# Altium project CAN-USB-Converter.PrjPcb
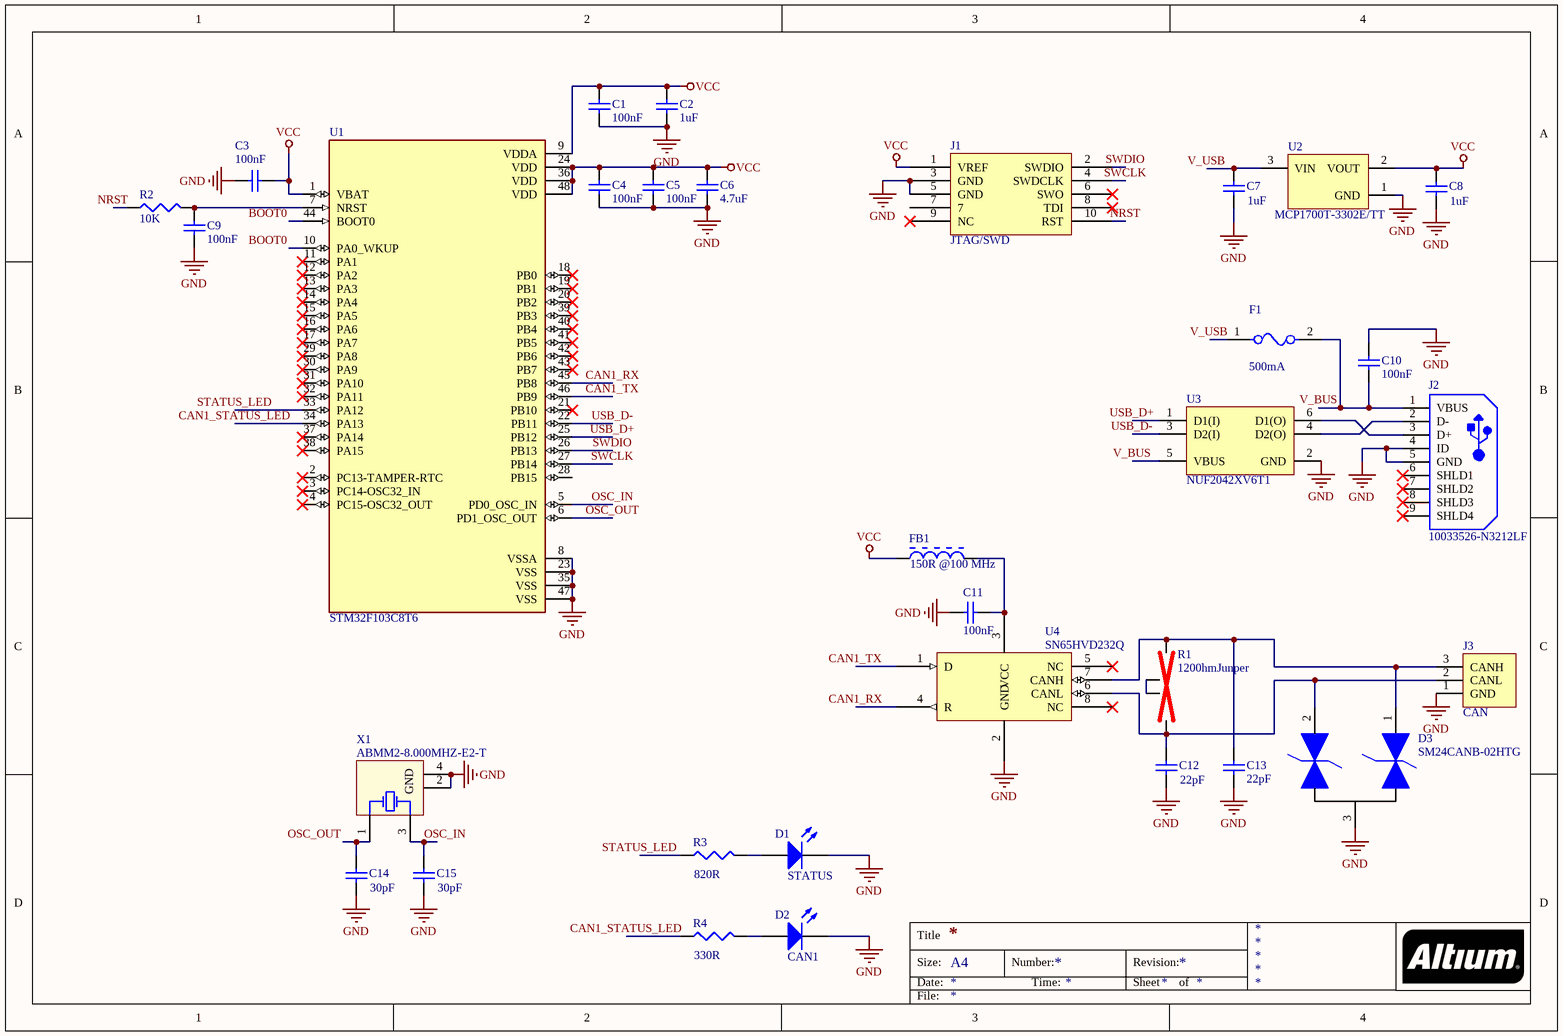
[diagram p0: Sheet1.SchDoc]
1 sheet, 32 parts. Net scope: global (net labels, ports and power ports of the same name join across sheets).
Board file: PCB2.PcbDoc

## Sheet Sheet1.SchDoc
size A4

### Parts
C1  value 100nF  [CAP0805]  (hidden comment: Cap Semi)
C2  value 1uF  [CAP0805]  (hidden comment: Cap Semi)
C3  value 100nF  [CAP0805]  (hidden comment: Cap Semi)
C4  value 100nF  [CAP0805]  (hidden comment: Cap Semi)
C5  value 100nF  [CAP0805]  (hidden comment: Cap Semi)
C6  value 4.7uF  [CAP0805]  (hidden comment: Cap Semi)
C7  value 1uF  [CAP0805]  (hidden comment: Cap Semi)
C8  value 1uF  [CAP0805]  (hidden comment: Cap Semi)
C9  value 100nF  [CAP0805]  (hidden comment: Cap Semi)
C10  value 100nF  [CAP0805]  (hidden comment: Cap Semi)
C11  value 100nF  [CAP0805]  (hidden comment: Cap Semi)
C12  value 22pF  [CAP0805]  (hidden comment: Cap Semi)
C13  value 22pF  [CAP0805]  (hidden comment: Cap Semi)
C14  value 30pF  [CAP0805]  (hidden comment: Cap Semi)
C15  value 30pF  [CAP0805]  (hidden comment: Cap Semi)
D1  STATUS  [0603_A]
D2  CAN1  [0603_A]
D3  SM24CANB-02HTG  [SOT-23-3]
F1  500mA  [FP-0154-MFG]
FB1  150R @100 MHz  [MURA-BLM21-H1-CHIP-2_V]
J1  JTAG/SWD  [61301021021]
J2  10033526-N3212LF  [FCI-10033526-N3212LF_V]
J3  CAN  [3PIN-Screw-Terminal]
R1  1200hmJunper  [120ohmJumper]
R2  value 10K  [RES0805]  (hidden comment: Res3)
R3  value 820R  [RES0805]  (hidden comment: Res3)
R4  value 330R  [RES0805]  (hidden comment: Res3)
U1  STM32F103C8T6  [STM32F103C8T6]
U2  MCP1700T-3302E/TT  [SOT-23-TT3_N]
U3  NUF2042XV6T1  [ONSC-SOT-563-6-463A-01_V]
U4  SN65HVD232Q  [SO-8_S]
X1  ABMM2-8.000MHZ-E2-T  [ABRA-ABMM2-4_V]

### Nets
GND: C1.1 C2.1 C3.1 C4.1 C5.1 C6.1 C7.1 C8.1 C9.1 C10.1 C11.1 C12.1 C13.2 C14.1 C15.1 D1.1(K) D2.1(K) D3.3 J1.3(GND) J1.5(GND) J2.4(ID) J2.5(GND) J3.1(GND) U1.8(VSSA) U1.23(VSS) U1.35(VSS) U1.47(VSS) U2.1(GND) U3.2(GND) U4.2(GND) X1.2(GND) X1.4(GND)
VCC: C1.2 C2.2 C3.2 C4.2 C5.2 C6.2 C8.2 FB1.1 J1.1(VREF) U1.1(VBAT) U1.9(VDDA) U1.24(VDD) U1.36(VDD) U1.48(VDD) U2.2(VOUT)
BOOT0: U1.10(PA0_WKUP) U1.44(BOOT0)
CAN1_RX: U1.45(PB8) U4.4(R)
CAN1_STATUS_LED: R4.1 U1.34(PA13)
CAN1_TX: U1.46(PB9) U4.1(D)
NRST: J1.10(RST) R2.2
OSC_IN: C15.2 U1.5(PD0_OSC_IN) X1.3(X2)
OSC_OUT: C14.2 U1.6(PD1_OSC_OUT) X1.1(X1)
STATUS_LED: R3.1 U1.33(PA12)
SWCLK: J1.4(SWDCLK) U1.27(PB14)
SWDIO: J1.2(SWDIO) U1.26(PB13)
USB_D+: U1.25(PB12) U3.1(D1(I))
USB_D-: U1.22(PB11) U3.3(D2(I))
V_BUS: C10.2 F1.2 J2.1(VBUS) U3.5(VBUS)
V_USB: C7.2 F1.1 U2.3(VIN)
NetC9_2: C9.2 R2.1 U1.7(NRST)
NetC11_2: C11.2 FB1.2 U4.3(VCC)
NetC12_2: C12.2 D3.2 J3.2(CANL) R1.2 U4.6(CANL)
NetC13_1: C13.1 D3.1 J3.3(CANH) R1.1 U4.7(CANH)
NetD1_2: D1.2(A) R3.2
NetD2_2: D2.2(A) R4.2
NetJ2_2: J2.2(D-) U3.4(D2(O))
NetJ2_3: J2.3(D+) U3.6(D1(O))
NetR1_3: R1.3 R1.4

Not connected (* = marked no-connect by the designer): J1 6(SWO)* 7 8(TDI)* 9(NC)*; J2 6(SHLD1)* 7(SHLD2)* 8(SHLD3)* 9(SHLD4)*; U1 2(PC13-TAMPER-RTC)* 3(PC14-OSC32_IN)* 4(PC15-OSC32_OUT)* 11(PA1)* 12(PA2)* 13(PA3)* 14(PA4)* 15(PA5)* 16(PA6)* 17(PA7)* 18(PB0)* 19(PB1)* 20(PB2)* 21(PB10)* 28(PB15) 29(PA8)* 30(PA9)* 31(PA10)* 32(PA11)* 37(PA14)* 38(PA15)* 39(PB3)* 40(PB4)* 41(PB5)* 42(PB6)* 43(PB7)*; U4 5(NC)* 8(NC)*

### Notes on the sheet
- Title
- Size:
- Date:
- A4
- Number:
- Time:
- Revision:
- Sheet
- of
- File:

### Library data of the parts
C1-C15 = Cap Semi: Capacitor (Semiconductor SIM Model); Published: 8-Jun-2000; LatestRevisionDate: 29-May-2009; LatestRevisionNote: IPC-7351 Footprint Added.; PackageReference: C1206; Publisher: Altium Limited; PackageDescription: Chip Capacitor
D1 = CMP-1426-00001-1: SMD mono-color Chip LED, WL-SMCW, Red; Manufacturer: Wuerth Elektronik; PartNumber: 150060RS75000; Color: Red; PackageReference: 0603_A; ComponentLink2URL: http://katalog.we-online.com/led/datasheet/150060RS75000.pdf; ComponentLink1URL: http://www.we-online.com; ComponentLink1Description: Manufacturer URL; ComponentLink2Description: Datasheet
D2 = CMP-1426-00002-1: SMD mono-color Chip LED, WL-SMCW, Green; PartNumber: 150060GS75000; Manufacturer: Wuerth Elektronik; ComponentLink1URL: http://www.we-online.com; ComponentLink2Description: Datasheet; Color: Green; ComponentLink2URL: http://katalog.we-online.com/led/datasheet/150060GS75000.pdf; PackageReference: 0603_A; ComponentLink1Description: Manufacturer URL
F1 = CMP-08605-000021-1: FUSE BOARD MNT 500MA 125VAC/VDC; Manufacturer: Littelfuse; Manufacturer Part Number: 0154.500DRT; Max Fuse Ac Voltage: 125V; Fuse Blow Speed: Slow; Fuse Current: 0.5A; Fuse I2T: 0.24A2Sec; Package: 0154; Automotive: No; ComponentLink2URL: https://www.littelfuse.com/~/media/electronics/datasheets/fuses/littelfuse_fuse_154_154t_154l_154tl_datasheet.pdf.pdf; RoHS: TRUE; Octopart: https://octopart.com/0154.500drt-littelfuse-565915; Device Class L2: Fuses; Temperature: -55°C to +125°C; Temperature Range Low: -55°C; Device Class L1: Circuit Protection; Temperature Range High: +125°C; Mouser Description: Surface Mount Fuses Fuseblck w/ fuse .5A OMNI BLOK 154T; Lead Free: Yes; ComponentLink2Description: Datasheet; Digikey Description: FUSE BOARD MNT 500MA 125VAC/VDC; Height: 3.81mm; Device Class L3: unset; Max Fuse Dc Voltage: 125V; Category: Fuse
FB1 = CMP-0686-00717-2: Chip Ferrite Bead for General Signal lines, 150 Ohm, 800 mA, -55 to 125 degC, 2 x 1.25 x 1.05 mm SMD, Tape and Reel; Manufacturer: Murata; PartNumber: BLM21AG151SN1D; Impedance (at 100 MHz): 150 Ohm +/- 25%; Rated Current: 800 mA; DC Resistance: 0.1 Ohm Max.; ComponentLink3URL: http://www.murata.com/products/catalog/pdf/c31e.pdf; PackageReference: BLM21_H1050-2; ComponentLink2URL: http://www.murata.com/products/catalog/pdf/c31e.pdf; DatasheetVersion: 08/2013; PackageDescription: 2-Pin Chip, Body 2 x 1.25 mm; Operating Temperature Range: -55 to 125 degC; ComponentLink3Description: Package Specification; Packing: Tape and Reel; Mounting Technology: Surface Mount; ComponentLink2Description: Datasheet; ComponentLink1Description: Manufacturer URL; ComponentLink1URL: http://www.murata.com/
J2 = CMP-1698-00001-3: Mini USB B-Type, 5-Pin SMD, RoHS, Tape and Reel; Height: 4 mm; PackageDescription: 5-Pin Surface Mount Device, Body 9.2 x 7.7 mm, Pitch 0.8 mm; ComponentLink2Description: Datasheet; Pins: 5; RoHSCompliant: True; DatasheetVersion: Rev. N; ComponentLink1Description: Manufacturer URL; Length: 9.9 mm; PartNumber: 10033526-N3212LF; Package Quantity: 1; Packaging: Tape and Reel; Mount: Surface Mount; Mounting Technology: Surface Mount; ComponentLink1URL: http://portal.fciconnect.com/; ComponentLink2URL: http://portal.fciconnect.com/Comergent//fci/drawing/10033526.pdf
J3 = 3PIN-Screw-Terminal
R2-R4 = Res3: Resistor; Published: 8-Jun-2000; LatestRevisionDate: 29-May-2009; LatestRevisionNote: IPC-7351 Footprint Added.; PackageReference: J1-0603; Publisher: Altium Limited; PackageDescription: Chip Resistor
U1 = STM32F103C8T6: ARMÂ® CortexÂ®-M3 STM32F1 Microcontroller IC 32-Bit 72MHz 64KB _64K x 8_ FLASH; MF: STMicroelectronics; Price: None; Package: LQFP-48 STMicroelectronics; Value: *; MP: STM32F103C8T6; Availability: Unavailable; SnapEDA_Link: https://www.snapeda.com/parts/STM32F103C8T6/STMicroelectronics/view-part/52195/?ref=snap
U2 = CMP-0136-00791-1: Low Quiescent Current LDO, 3-Pin SOT-23, Extended Temperature, Tape and Reel; PackageVersion: revBB, Aug-2009; Code_IPC: SOT23-3; PackageReference: SOT-23-TT3; DatasheetVersion: revB, Feb-2007; PackageDescription: 3-Lead Plastic Small Outline Transistor (TT) [SOT-23]
U3 = CMP-1066-00026-1: USB Upstream Terminator with ESD Protection, 6-Pin SOT-563, Pb-Free, Tape and Reel; Manufacturer: On Semiconductor; Number of Lines: 3; VRWM Max (V): 5.25; V(BR) Typ (V): 6.8; C Typ (pF): 42; Mounting Technology: Surface Mount; PackageVersion: Rev. F, 04/2005; ComponentLink1Description: Manufacturer URL; ComponentLink2Description: Datasheet; PackageReference: SOT-563-6-463A-01; ComponentLink2URL: http://www.onsemi.cn/pub_link/Collateral/NUF2030XV6-D.PDF; PartNumber: NUF2042XV6T1; DatasheetVersion: Rev. 2; ComponentLink3Description: Package Specification; RoHS: Pb-Free; PackageDescription: 6-Pin Small Outline Transistor, Body 1.6 x 1.2 mm, Pitch 0.5 mm; ComponentLink1URL: http://www.onsemi.com/; ComponentLink3URL: http://www.onsemi.cn/pub_link/Collateral/463A-01.PDF; Packing: Tape and Reel
X1 = CMP-0277-00003-1: Ceramic Surface Mount Low Profile Quartz Crystal, 8 MHz, -20 to 70 degC, 4-Pin 6 x 3.6 x 1.2 mm SMD, RoHS, 1000pcs / Reel; Manufacturer: Abracon; ESR: 72 Ohm Max.; Frequency: 8 MHz; Shunt Capacitance C0: 7 pF Max.; Load Capacitance CL: 18 pF Typ.; ComponentLink3Description: Package Specification; PackageDescription: 4-Pin SMD, Body 6 x 3.6 mm, Pitch 4.4 mm; DatasheetVersion: Jan-13; ComponentLink1URL: http://www.abracon.com/; ComponentLink2URL: http://www.abracon.com/Resonators/ABMM2.pdf; Temperature Range: -20 to 70 degC; Mounting Technology: Surface Mount; RoHS: TRUE; PartNumber: ABMM2-8.000MHZ-E2-T; ComponentLink2Description: Datasheet; ComponentLink3URL: http://www.abracon.com/Resonators/ABMM2.pdf; ComponentLink1Description: Manufacturer URL; Packing: 1000pcs / Reel